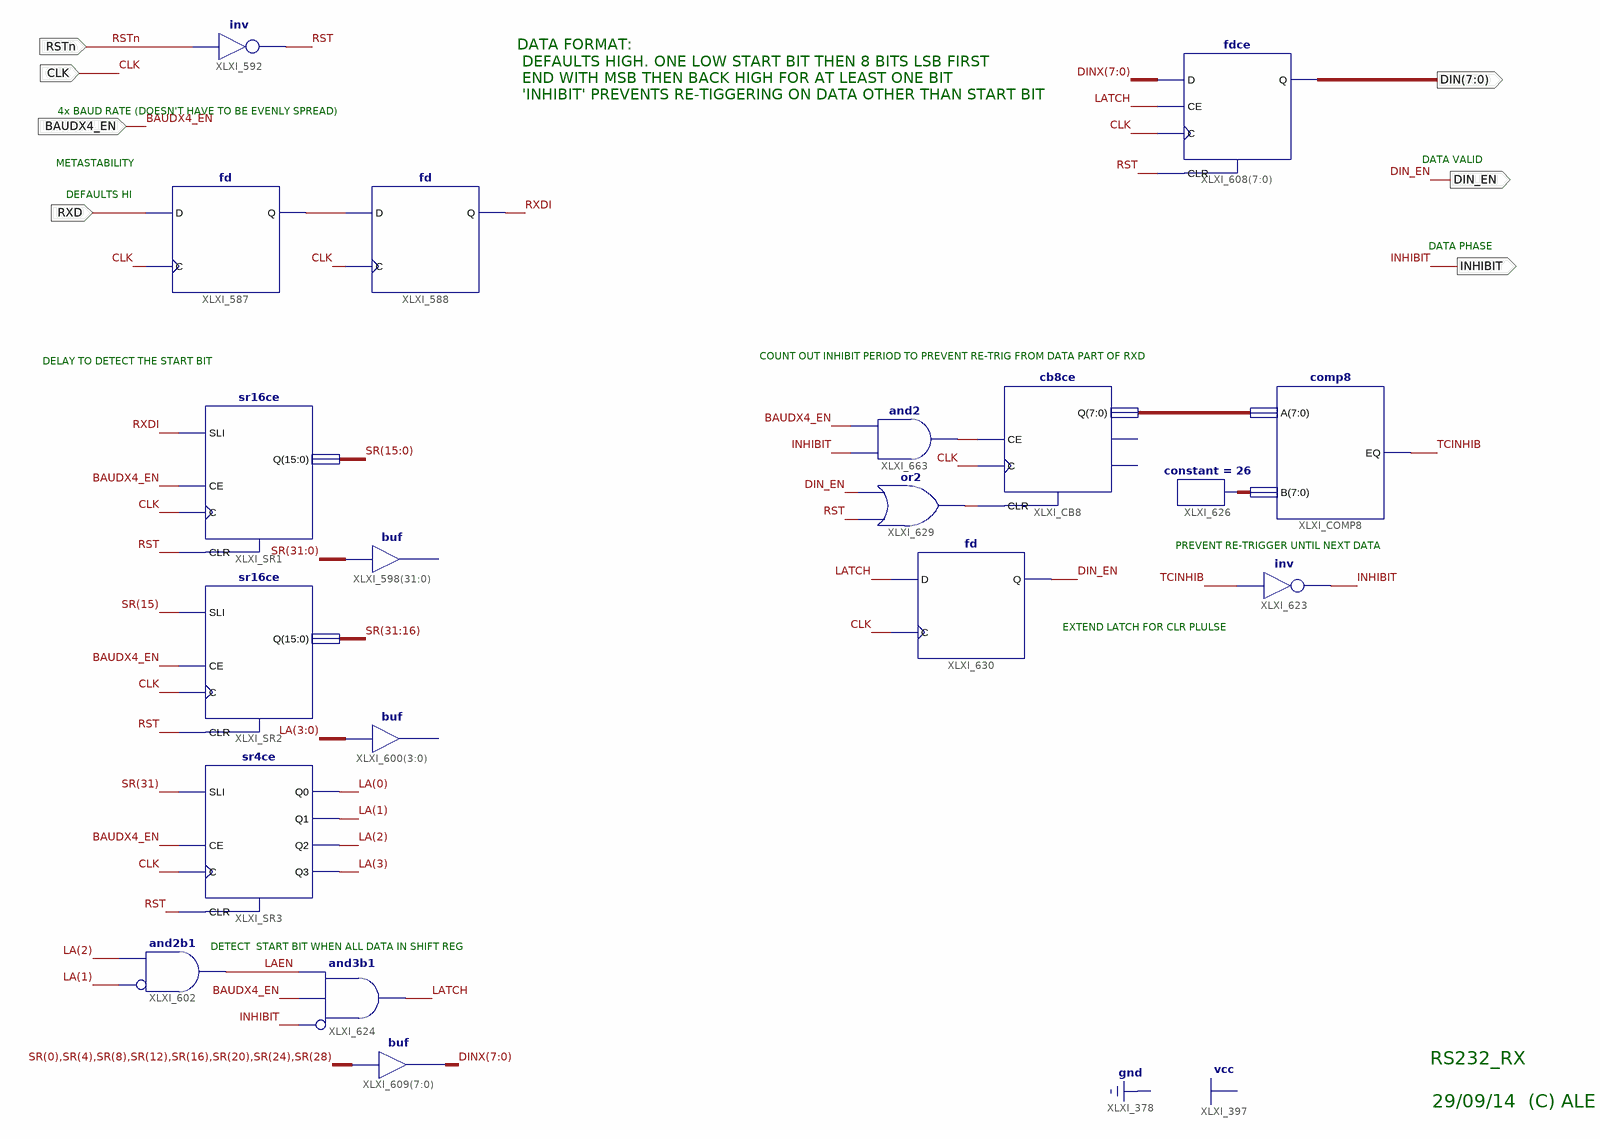
[diagram p0: schematic sheet 1]
// Xilinx ISE schematic RS232_RX.sch (zynq) as structural Verilog: 19 symbols, 7 ports
module RS232_RX (
  input  CLK,
  input  RSTn,
  input  RXD,
  input  BAUDX4_EN,
  output INHIBIT,
  output DIN_EN,
  output [7:0] DIN
);

  wire LAEN, LATCH, RST, RXDI, TCINHIB, XLXN_119, XLXN_215, XLXN_233;
  wire [3:0] LA;
  wire [7:0] DINX, XLXN_225, XLXN_227;
  wire [31:0] SR;

  fd XLXI_588 (.C(CLK), .D(XLXN_119), .Q(RXDI));
  fd XLXI_587 (.C(CLK), .D(RXD), .Q(XLXN_119));
  not XLXI_592 (RST, RSTn);
  sr16ce XLXI_SR1 (.C(CLK), .CE(BAUDX4_EN), .CLR(RST), .SLI(RXDI), .Q(SR[15:0]));
  sr16ce XLXI_SR2 (.C(CLK), .CE(BAUDX4_EN), .CLR(RST), .SLI(SR[15]), .Q(SR[31:16]));
  sr4ce XLXI_SR3 (.C(CLK), .CE(BAUDX4_EN), .CLR(RST), .SLI(SR[31]), .Q0(LA[0]), .Q1(LA[1]), .Q2(LA[2]), .Q3(LA[3]));
  and XLXI_602 (LAEN, ~LA[1], LA[2]);  // and2b1
  and XLXI_624 (LATCH, ~INHIBIT, BAUDX4_EN, LAEN);  // and3b1
  // buf XLXI_598[31..0] has open pins: I=SR, O=open
  // buf XLXI_600[3..0] has open pins: I=LA, O=open
  assign DINX = {SR[0], SR[4], SR[8], SR[12], SR[16], SR[20], SR[24], SR[28]};  // buf XLXI_609[7..0], 8 bits wide
  comp8 XLXI_COMP8 (.A(XLXN_225), .B(XLXN_227), .EQ(TCINHIB));
  constant #(.CValue("26")) XLXI_626 (.O(XLXN_227));
  not XLXI_623 (INHIBIT, TCINHIB);
  or XLXI_629 (XLXN_233, RST, DIN_EN);
  and XLXI_663 (XLXN_215, INHIBIT, BAUDX4_EN);
  cb8ce XLXI_CB8 (.C(CLK), .CE(XLXN_215), .CLR(XLXN_233), .Q(XLXN_225));  // open: CEO, TC
  fd XLXI_630 (.C(CLK), .D(LATCH), .Q(DIN_EN));
  fdce XLXI_608[7:0] (.C(CLK), .CE(LATCH), .CLR(RST), .D(DINX), .Q(DIN));

  // Notes on the sheet:
  //   DATA FORMAT:
  //   DEFAULTS HIGH. ONE LOW START BIT THEN 8 BITS LSB FIRST
  //   END WITH MSB THEN BACK HIGH FOR AT LEAST ONE BIT
  //   'INHIBIT' PREVENTS RE-TIGGERING ON DATA OTHER THAN START BIT
  //   4x BAUD RATE (DOESN'T HAVE TO BE EVENLY SPREAD)
  //   DATA VALID
  //   METASTABILITY
  //   DEFAULTS HI
  //   DATA PHASE
  //   COUNT OUT INHIBIT PERIOD TO PREVENT RE-TRIG FROM DATA PART OF RXD
  //   DELAY TO DETECT THE START BIT
  //   PREVENT RE-TRIGGER UNTIL NEXT DATA
  //   EXTEND LATCH FOR CLR PLULSE
  //   DETECT  START BIT WHEN ALL DATA IN SHIFT REG
  //   RS232_RX
  //   29/09/14  (C) ALE
endmodule
